# Altium schematic sheet Ethernet Interface Group.SchDoc
size 209 x 297 mm; Author: ALTIUM GOSTBOM2.0 KEV; SheetNumber: 9; SheetTotal: 48
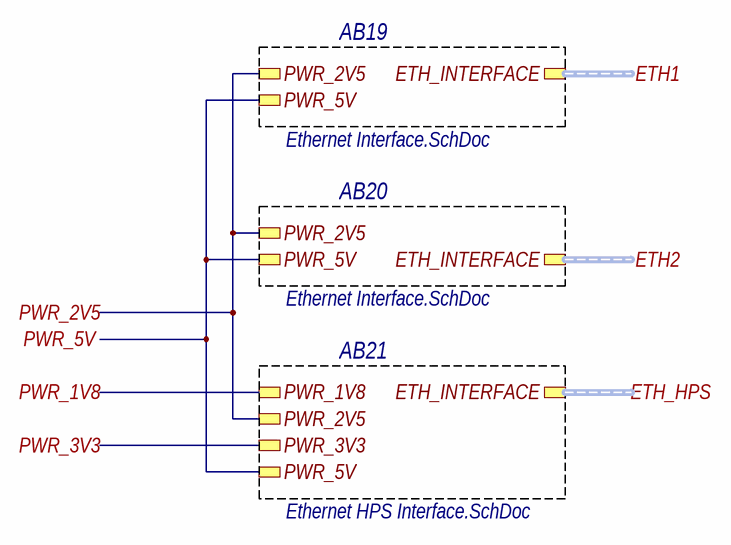
[diagram p0: Ethernet Interface Group.SchDoc]

## Sub-sheets
AB19 = Ethernet Interface.SchDoc: PWR_5V, ETH_INTERFACE (harness ETHERNET), PWR_2V5
AB20 = Ethernet Interface.SchDoc: PWR_5V, ETH_INTERFACE (harness ETHERNET), PWR_2V5
AB21 = Ethernet HPS Interface.SchDoc: ETH_INTERFACE (harness ETHERNET_HPS), PWR_5V, PWR_3V3, PWR_2V5, PWR_1V8

## Ports
ETH1 (harness ETHERNET), ETH2 (harness ETHERNET), ETH_HPS (harness ETHERNET_HPS), PWR_1V8, PWR_2V5, PWR_3V3, PWR_5V

## Nets
PWR_1V8: port PWR_1V8, sheet AB21/PWR_1V8
PWR_2V5: port PWR_2V5, sheet AB19/PWR_2V5, sheet AB21/PWR_2V5, sheet AB20/PWR_2V5
PWR_3V3: port PWR_3V3, sheet AB21/PWR_3V3
PWR_5V: port PWR_5V, sheet AB19/PWR_5V, sheet AB21/PWR_5V, sheet AB20/PWR_5V

## Buses and harness runs
harness port ETH1 = sheet AB19/ETH_INTERFACE
harness port ETH2 = sheet AB20/ETH_INTERFACE
harness port ETH_HPS = sheet AB21/ETH_INTERFACE

## Notes on the sheet
- Подп. дата
- Инв. № дубл.
- Взам. инв. №
- Подп. и дата
- Инв. № подл.
- Изм.
- Лист
- № докум.
- Подп.
- Дата
- Файл:
- ALTIUM GOSTBOM2.0 KEV
- Копировал
- Формат А4